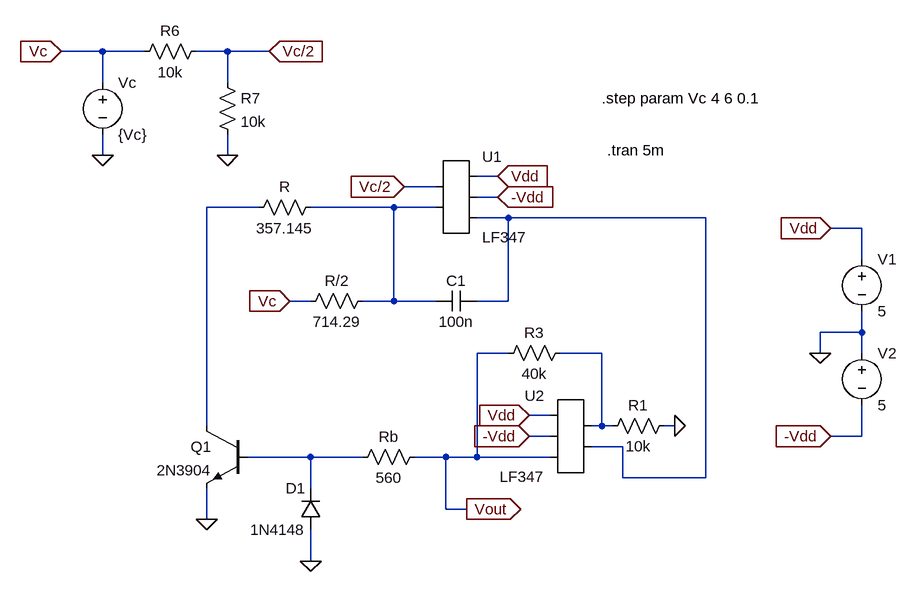
[diagram p0: schematic Q2.asc]
Q2.asc, the LTspice schematic file:
Version 4
SHEET 1 1148 804
WIRE -240 -16 -304 -16
WIRE -176 -16 -240 -16
WIRE -48 -16 -96 -16
WIRE 16 -16 -48 -16
WIRE -240 32 -240 -16
WIRE -48 32 -48 -16
WIRE -240 144 -240 112
WIRE -48 144 -48 112
WIRE 368 176 336 176
WIRE 272 192 224 192
WIRE 368 208 336 208
WIRE 0 224 -80 224
WIRE 208 224 80 224
WIRE 272 224 208 224
WIRE 384 240 336 240
WIRE 688 240 384 240
WIRE 928 256 880 256
WIRE 928 304 928 256
WIRE 80 368 48 368
WIRE 208 368 208 224
WIRE 208 368 160 368
WIRE 272 368 208 368
WIRE 384 368 384 240
WIRE 384 368 336 368
WIRE 928 416 928 384
WIRE 928 416 864 416
WIRE 384 448 336 448
WIRE 528 448 464 448
WIRE 864 448 864 416
WIRE 928 448 928 416
WIRE 448 544 416 544
WIRE -80 560 -80 224
WIRE 528 560 528 448
WIRE 528 560 512 560
WIRE 544 560 528 560
WIRE 640 560 624 560
WIRE 448 576 416 576
WIRE 928 576 928 528
WIRE 928 576 880 576
WIRE 560 592 512 592
WIRE 80 608 -16 608
WIRE 160 608 80 608
WIRE 288 608 240 608
WIRE 336 608 336 448
WIRE 336 608 288 608
WIRE 448 608 336 608
WIRE 560 640 560 592
WIRE 688 640 688 240
WIRE 688 640 560 640
WIRE 80 656 80 608
WIRE 288 688 288 608
WIRE 320 688 288 688
WIRE -80 704 -80 656
WIRE 80 768 80 720
FLAG 864 448 0
FLAG 880 256 Vdd
IOPIN 880 256 In
FLAG 880 576 -Vdd
IOPIN 880 576 In
FLAG 368 176 Vdd
IOPIN 368 176 In
FLAG 368 208 -Vdd
IOPIN 368 208 In
FLAG 640 560 0
FLAG 416 544 Vdd
IOPIN 416 544 In
FLAG 416 576 -Vdd
IOPIN 416 576 In
FLAG -80 704 0
FLAG -240 144 0
FLAG -48 144 0
FLAG -304 -16 Vc
IOPIN -304 -16 In
FLAG 16 -16 Vc/2
IOPIN 16 -16 In
FLAG 224 192 Vc/2
IOPIN 224 192 In
FLAG 48 368 Vc
IOPIN 48 368 In
FLAG 80 768 0
FLAG 320 688 Vout
IOPIN 320 688 Out
SYMBOL AutoGenerated/LF347 304 208 R0
SYMATTR InstName U1
SYMBOL res 176 352 R90
WINDOW 0 0 56 VBottom 2
WINDOW 3 32 56 VTop 2
SYMATTR InstName R/2
SYMATTR Value 714.29
SYMBOL cap 336 352 R90
WINDOW 0 0 32 VBottom 2
WINDOW 3 32 32 VTop 2
SYMATTR InstName C1
SYMATTR Value 100n
SYMBOL voltage 928 288 R0
SYMATTR InstName V1
SYMATTR Value 5
SYMBOL voltage 928 432 R0
SYMATTR InstName V2
SYMATTR Value 5
SYMBOL res 96 208 R90
WINDOW 0 0 56 VBottom 2
WINDOW 3 32 56 VTop 2
SYMATTR InstName R
SYMATTR Value 357.145
SYMBOL npn -16 560 M0
SYMATTR InstName Q1
SYMATTR Value 2N3904
SYMBOL AutoGenerated/LF347 480 576 M0
SYMATTR InstName U2
SYMBOL res 640 544 R90
WINDOW 0 0 56 VBottom 2
WINDOW 3 32 56 VTop 2
SYMATTR InstName R1
SYMATTR Value 10k
SYMBOL res 480 432 R90
WINDOW 0 0 56 VBottom 2
WINDOW 3 32 56 VTop 2
SYMATTR InstName R3
SYMATTR Value 40k
SYMBOL res 256 592 R90
WINDOW 0 0 56 VBottom 2
WINDOW 3 32 56 VTop 2
SYMATTR InstName Rb
SYMATTR Value 560
SYMBOL voltage -240 16 R0
SYMATTR InstName Vc
SYMATTR Value {Vc}
SYMBOL res -80 -32 R90
WINDOW 0 0 56 VBottom 2
WINDOW 3 32 56 VTop 2
SYMATTR InstName R6
SYMATTR Value 10k
SYMBOL res -64 16 R0
SYMATTR InstName R7
SYMATTR Value 10k
SYMBOL diode 96 720 R180
WINDOW 0 24 64 Left 2
WINDOW 3 24 0 Left 2
SYMATTR InstName D1
SYMATTR Value 1N4148
TEXT 536 136 Left 2 !.tran 5m
TEXT 528 56 Left 2 !.step param Vc 4 6 0.1

The netlist it stands for:
* Q2.asc
* U1: LF347 (symbol AutoGenerated/LF347 not available, pins judged from their places): pin1=Vc/2 pin2=N002 pin3=Vdd pin4=-Vdd pin5=N003
R/2 N002 Vc 714.29
C1 N003 N002 100n
V1 Vdd 0 5
V2 0 -Vdd 5
R N002 N001 357.145
Q1 N001 N005 0 0 2N3904
* U2: LF347 (symbol AutoGenerated/LF347 not available, pins judged from their places): pin1=N004 pin2=N003 pin3=Vdd pin4=-Vdd pin5=Vout
R1 0 N004 10k
R3 N004 Vout 40k
Rb Vout N005 560
Vc Vc 0 {Vc}
R6 Vc/2 Vc 10k
R7 Vc/2 0 10k
D1 0 N005 1N4148
.model D D
.lib standard.dio
.model NPN NPN
.model PNP PNP
.lib standard.bjt
.tran 5m
.step param Vc 4 6 0.1
.backanno
.end